# Altium schematic sheet power_12V.SchDoc: 12V PWR
size A4; Organization: Badgerloop Electrical; Address1: 133 Engineering Research Building; Address2: 1500 Engineering Drive; Address3: Madison, Wi 53706; SheetNumber: 6
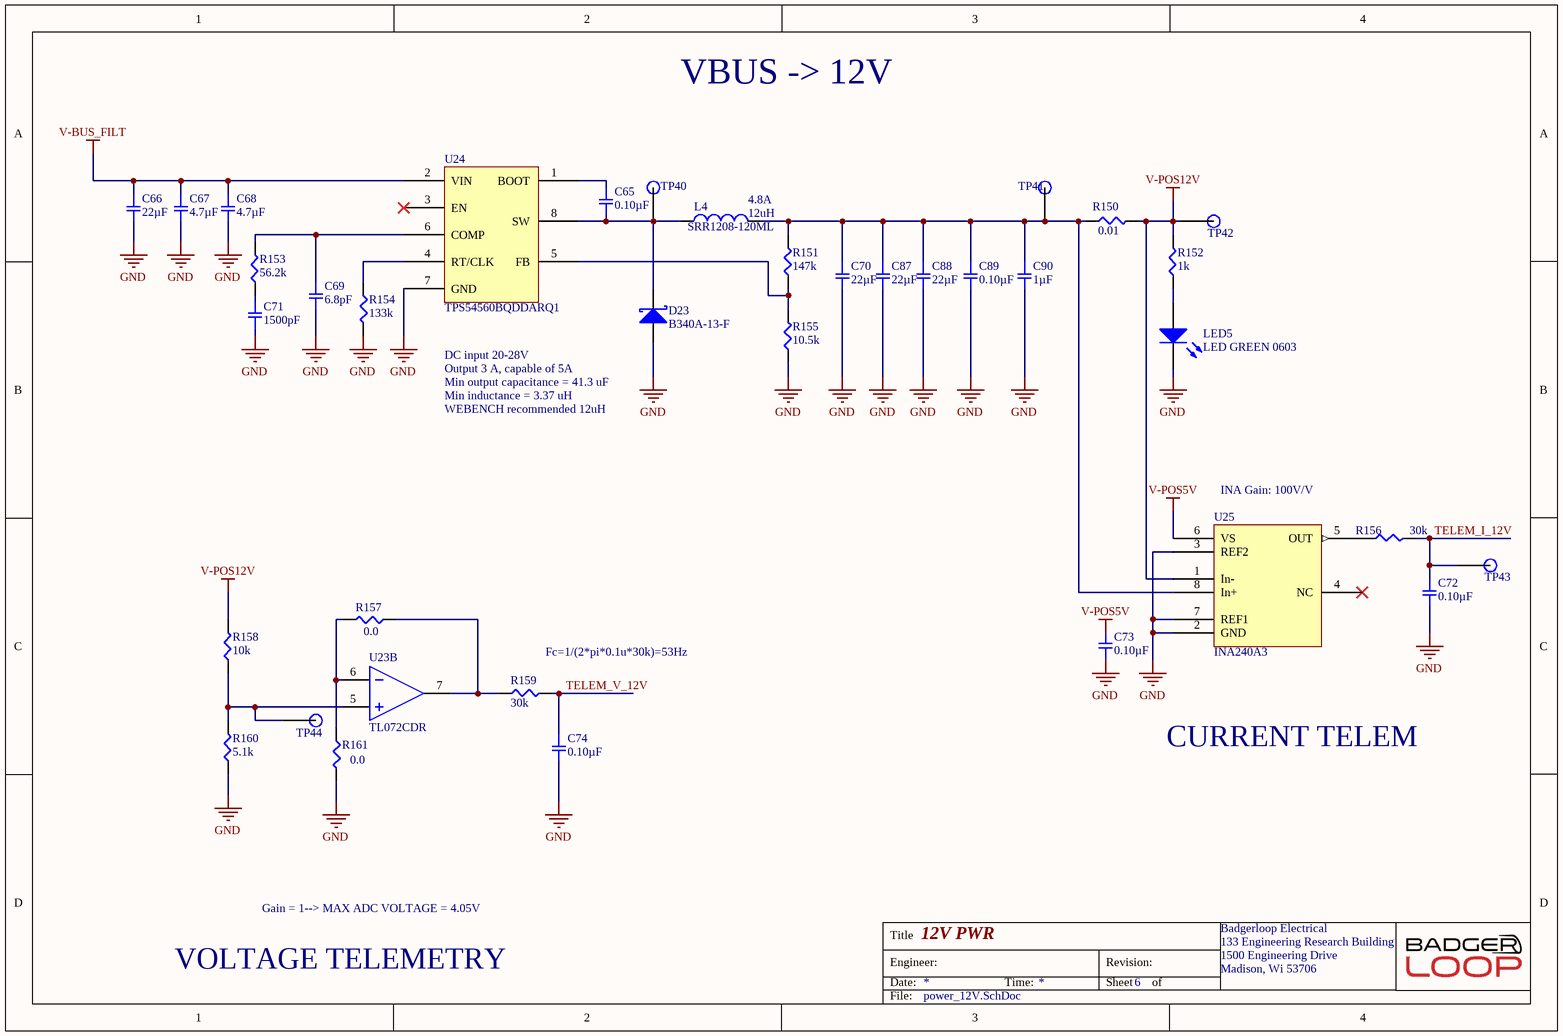
[diagram p0: power_12V.SchDoc]

## Parts
C65  0.10µF  [SMD-0805C]
C66  22µF  [SMD-1206C]
C67  4.7µF  [SMD-0805C]
C68  4.7µF  [SMD-0805C]
C69  6.8pF  [SMD-0805C]
C70  22µF  [SMD-1206C]
C71  1500pF  [SMD-0805C]
C72  0.10µF  [SMD-0805C]
C73  0.10µF  [SMD-0805C]
C74  0.10µF  [SMD-0805C]
C87  22µF  [SMD-1206C]
C88  22µF  [SMD-1206C]
C89  0.10µF  [SMD-0805C]
C90  1µF  [SMD-0805C]
D23  B340A-13-F  [DIOM4326X20N]
L4  SRR1208-120ML  Current Rating: 4.8A  Inductance: 12uH  [INDP127127X83N]
LED5  LED GREEN 0603  [LED 0603 GREEN]
R150  0.01  [SMD-1206-RES]
R151  147k  [SMD-0805-RES]
R152  1k  [SMD-0805-RES]
R153  56.2k  [SMD-0805-RES]
R154  133k  [SMD-0805-RES]
R155  10.5k  [SMD-0805-RES]
R156  30k  [SMD-0805-RES]
R157  0.0  [SMD-0805-RES]
R158  10k  [SMD-0805-RES]
R159  30k  [SMD-0805-RES]
R160  5.1k  [SMD-0805-RES]
R161  0.0  [SMD-0805-RES]
TP40  TP  [Test Point]  (value not drawn)
TP41  TP  [Test Point]  (value not drawn)
TP42  TP  [Test Point]  (value not drawn)
TP43  TP  [Test Point]  (value not drawn)
TP44  TP  [Test Point]  (value not drawn)
U23  TL072CDR  [SOP127P600X175-8N]  (part B of 2)
U24  TPS54560BQDDARQ1  [SOP127P600X175-8N - Thermal Pad]
U25  INA240A3  [SOIC127P600X175-8N]

## Nets
GND: C66.2 C67.2 C68.2 C69.2 C70.2 C71.1 C72.2 C73.1 C74.2 C87.2 C88.2 C89.2 C90.2 D23.2(A) LED5.2(K) R154.2 R155.1 R160.1 R161.2 U24.7(GND) U25.2(GND) U25.3(REF2) U25.7(REF1)
V-BUS_FILT: C66.1 C67.1 C68.1 U24.2(VIN)
V-POS5V: C73.2 U25.6(VS)
V-POS12V: R150.2 R152.2 R158.2 TP42.1 U25.1(In-)
TELEM_I_12V: C72.1 R156.2 TP43.1
TELEM_V_12V: C74.1 R159.2
NetC65_1: C65.1 U24.1(BOOT)
NetC65_2: C65.2 D23.1(K) L4.1 TP40.1 U24.8(SW)
NetC69_1: C69.1 R153.2 U24.6(COMP)
NetC70_1: C70.1 C87.1 C88.1 C89.1 C90.1 L4.2 R150.1 R151.2 TP41.1 U25.8(In+)
NetC71_2: C71.2 R153.1
NetLED5_1: LED5.1(A) R152.1
NetR151_1: R151.1 R155.2 U24.5(FB)
NetR154_1: R154.1 U24.4(RT/CLK)
NetR156_1: R156.1 U25.5(OUT)
NetR157_1: R157.1 R159.1 U23.7(OUT)
NetR157_2: R157.2 R161.1 U23.6(IN-)
NetR158_1: R158.1 R160.2 TP44.1 U23.5(IN+)

Not connected (* = marked no-connect by the designer): U24 3(EN)*; U25 4(NC)*

## Notes on the sheet
- VBUS -> 12V
- DC input 20-28V
- Output 3 A, capable of 5A
- Min output capacitance = 41.3 uF
- Min inductance = 3.37 uH
- WEBENCH recommended 12uH
- (near U25) INA Gain: 100V/V
- (near R159) Fc=1/(2*pi*0.1u*30k)=53Hz
- CURRENT TELEM
- Gain = 1--> MAX ADC VOLTAGE = 4.05V
- VOLTAGE TELEMETRY
- Title
- Engineer:
- Date:
- Time:
- Revision:
- Sheet
- of
- File:

## Library data of the parts
C65 = GCD21BR71H104KA01L: CAP CER 0.1UF 50V X7R 0805; Manufacturer: Murata Electronics North America; Factory Stock: 0; Unit Price (USD): 0.24; Minimum Quantity: 1; Tolerance: ±10%; Datasheets: http://www.murata.com/~/media/webrenewal/support/library/catalog/products/capacitor/mlcc/c03e.ashx; Image: //media.digikey.com/Renders/Murata%20Renders/0805%28GxM6%29.jpg; Digi-Key Part Number: 490-11955-1-ND; Part Number: GCD21BR71H104KA01L; Quantity Available: 157; @ qty: 0; Packaging: Cut Tape (CT); Series: GCD; Part Status: Active; Value: 0.10µF; Voltage: 50V; Temperature Coefficient: X7R; Operating Temperature: -55°C ~ 125°C; Features: -; Ratings: AEC-Q200; Applications: Automotive; Mounting Type: Surface Mount, MLCC; Package / Case: 0805 (2012 Metric); Size / Dimension: 0.079" L x 0.049" W (2.00mm x 1.25mm); Height - Seated (Max): -; Thickness (Max): 0.049" (1.25mm); Lead Spacing: -; Lead Style: -
C66 C70 C87 C88 = GRT31CR61E226ME01L: CAP CER 22UF 25V X5R 1206; Manufacturer: Murata Electronics North America; Factory Stock: 0; Unit Price (USD): 0.52; Minimum Quantity: 1; Tolerance: ±20%; Datasheets: http://search.murata.co.jp/Ceramy/image/img/A01X/G101/ENG/GRT31CR61E226ME01-01.pdf; Image: //media.digikey.com/Renders/Murata%20Renders/GR331BD72E473KW01L.jpg; Digi-Key Part Number: 490-12451-1-ND; Part Number: GRT31CR61E226ME01L; Quantity Available: 4719; @ qty: 0; Packaging: Cut Tape (CT); Series: GRT; Part Status: Active; Value: 22µF; Voltage: 25V; Temperature Coefficient: X5R; Operating Temperature: -55°C ~ 85°C; Features: -; Ratings: AEC-Q200; Applications: Automotive; Mounting Type: Surface Mount, MLCC; Package / Case: 1206 (3216 Metric); Size / Dimension: 0.126" L x 0.063" W (3.20mm x 1.60mm); Height - Seated (Max): -; Thickness (Max): 0.071" (1.80mm); Lead Spacing: -; Lead Style: -
C67 C68 = GRT21BR61H475ME13L: CAP CER 4.7UF 50V X5R 0805; Manufacturer: Murata Electronics North America; Factory Stock: 0; Unit Price (USD): 0.37; Minimum Quantity: 1; Tolerance: ±20%; Datasheets: http://search.murata.co.jp/Ceramy/image/img/A01X/G101/ENG/GRT21BR61H475ME13-01.pdf; Image: //media.digikey.com/Renders/Murata%20Renders/GRT%20Series%200805(2012%20Metric).jpg; Digi-Key Part Number: 490-12395-1-ND; Part Number: GRT21BR61H475ME13L; Quantity Available: 4227; @ qty: 0; Packaging: Cut Tape (CT); Series: GRT; Part Status: Active; Value: 4.7µF; Voltage: 50V; Temperature Coefficient: X5R; Operating Temperature: -55°C ~ 85°C; Features: -; Ratings: AEC-Q200; Applications: Automotive; Mounting Type: Surface Mount, MLCC; Package / Case: 0805 (2012 Metric); Size / Dimension: 0.079" L x 0.049" W (2.00mm x 1.25mm); Height - Seated (Max): -; Thickness (Max): 0.057" (1.45mm); Lead Spacing: -; Lead Style: -
C69 = GQM2195C2A6R8CB01D: CAP CER 6.8PF 100V NP0 0805; Manufacturer: Murata Electronics North America; Factory Stock: 0; Unit Price (USD): 0.71; Minimum Quantity: 1; Tolerance: ±0.25pF; Temperature Coefficient: C0G, NP0; Datasheets: http://www.murata.com/~/media/webrenewal/support/library/catalog/products/capacitor/mlcc/c02e.pdf; Image: //media.digikey.com/Renders/Murata%20Renders/0805(GxM9).jpg; Digi-Key Part Number: 490-3596-1-ND; Part Number: GQM2195C2A6R8CB01D; Quantity Available: 5718; @ qty: 0; Packaging: Cut Tape (CT); Series: GQM; Part Status: Active; Value: 6.8pF; Voltage: 100V; Operating Temperature: -55°C ~ 125°C; Features: High Q, Low Loss; Ratings: -; Applications: RF, Microwave, High Frequency; Mounting Type: Surface Mount, MLCC; Package / Case: 0805 (2012 Metric); Size / Dimension: 0.079" L x 0.049" W (2.00mm x 1.25mm); Height - Seated (Max): -; Thickness (Max): 0.037" (0.95mm); Lead Spacing: -; Lead Style: -
C71 = GRM2165C1H152FA01D: CAP CER 1500PF 50V NP0 0805; Manufacturer: Murata Electronics North America; Factory Stock: 0; Unit Price (USD): 0.28; Minimum Quantity: 1; Tolerance: ±1%; Temperature Coefficient: C0G, NP0; Datasheets: http://www.murata.com/~/media/webrenewal/support/library/catalog/products/capacitor/mlcc/c02e.pdf; Image: //media.digikey.com/Renders/Murata%20Renders/0805%20(2012%20Metric)%20.85mm.jpg; Digi-Key Part Number: 490-7772-1-ND; Part Number: GRM2165C1H152FA01D; Quantity Available: 15785; @ qty: 0; Packaging: Cut Tape (CT); Series: GRM; Part Status: Active; Value: 1500pF; Voltage: 50V; Operating Temperature: -55°C ~ 125°C; Features: -; Ratings: -; Applications: General Purpose; Mounting Type: Surface Mount, MLCC; Package / Case: 0805 (2012 Metric); Size / Dimension: 0.079" L x 0.049" W (2.00mm x 1.25mm); Height - Seated (Max): -; Thickness (Max): 0.028" (0.70mm); Lead Spacing: -; Lead Style: -
C72 C74 = GRM219R71C104KA01D: CAP CER 0.1UF 16V X7R 0805; Manufacturer: Murata Electronics North America; Factory Stock: 0; Unit Price (USD): 0.13; Minimum Quantity: 1; Tolerance: ±10%; Datasheets: http://www.murata.com/~/media/webrenewal/support/library/catalog/products/capacitor/mlcc/c02e.pdf; Image: //media.digikey.com/Renders/Murata%20Renders/0805%20(2012%20Metric)%20.85mm.jpg; Digi-Key Part Number: 490-1683-1-ND; Part Number: GRM219R71C104KA01D; Quantity Available: 265464; @ qty: 0; Packaging: Cut Tape (CT); Series: GRM; Part Status: Active; Value: 0.10µF; Voltage: 16V; Temperature Coefficient: X7R; Operating Temperature: -55°C ~ 125°C; Features: -; Ratings: -; Applications: General Purpose; Mounting Type: Surface Mount, MLCC; Package / Case: 0805 (2012 Metric); Size / Dimension: 0.079" L x 0.049" W (2.00mm x 1.25mm); Height - Seated (Max): -; Thickness (Max): 0.037" (0.95mm); Lead Spacing: -; Lead Style: -
C73 C89 = GRM21B7U1A104JA01L: CAP CER 0.1UF 10V U2J 0805; Manufacturer: Murata Electronics North America; Factory Stock: 0; Unit Price (USD): 0.4; Minimum Quantity: 1; Tolerance: ±5%; Datasheets: http://www.murata.com/~/media/webrenewal/support/library/catalog/products/capacitor/mlcc/c02e.pdf; Image: //media.digikey.com/Renders/Murata%20Renders/0805%20(2012%20Metric)%20.85mm.jpg; Digi-Key Part Number: 490-11592-1-ND; Part Number: GRM21B7U1A104JA01L; Quantity Available: 3390; @ qty: 0; Packaging: Cut Tape (CT); Series: GRM; Part Status: Active; Value: 0.10µF; Voltage: 10V; Temperature Coefficient: U2J; Operating Temperature: -55°C ~ 125°C; Features: -; Ratings: -; Applications: General Purpose; Mounting Type: Surface Mount, MLCC; Package / Case: 0805 (2012 Metric); Size / Dimension: 0.079" L x 0.049" W (2.00mm x 1.25mm); Height - Seated (Max): -; Thickness (Max): 0.053" (1.35mm); Lead Spacing: -; Lead Style: -
C90 = GRM21BR71H105KA12L: CAP CER 1UF 50V X7R 0805; Manufacturer: Murata Electronics North America; Factory Stock: 0; Unit Price (USD): 0.25; Minimum Quantity: 1; Tolerance: ±10%; Datasheets: http://www.murata.com/~/media/webrenewal/support/library/catalog/products/capacitor/mlcc/c02e.pdf; Image: //media.digikey.com/Renders/Murata%20Renders/0805%20(2012%20Metric)%20.85mm.jpg; Digi-Key Part Number: 490-4736-1-ND; Part Number: GRM21BR71H105KA12L; Quantity Available: 988032; @ qty: 0; Packaging: Cut Tape (CT); Series: GRM; Part Status: Active; Value: 1µF; Voltage: 50V; Temperature Coefficient: X7R; Operating Temperature: -55°C ~ 125°C; Features: -; Ratings: -; Applications: General Purpose; Mounting Type: Surface Mount, MLCC; Package / Case: 0805 (2012 Metric); Size / Dimension: 0.079" L x 0.049" W (2.00mm x 1.25mm); Height - Seated (Max): -; Thickness (Max): 0.053" (1.35mm); Lead Spacing: -; Lead Style: -
D23 = B340A-13-F: DIODE SCHOTTKY 40V 3A SMA; Manufacturer: Diodes; Element Configuration: Single; Peak Reverse Current: 500uA; Forward Voltage: 500mV; Max Forward Surge Current (Ifsm): 80A; Polarity: Standard; Capacitance: 250pF; Supplier 1: Digi-Key; Stock 1: 438328; Pricing 1: 1=0.42000, 10=0.33900, 100=0.23070, 500=0.17304, 1000=0.12978 (USD); RoHS: Yes; Mount: Surface Mount; Case/Package: SMA; Number of Pins: 2; Weight: 0.002258oz; Contact Plating: Tin,Matte; Min Operating Temperature: -55°C; Max Operating Temperature: 125°C; Forward Current: 3A; Max Repetitive Reverse Voltage (Vrrm): 40V; Packaging: Tape and Reel; Peak Non-Repetitive Surge Current: 80A; Package Quantity: 5000; Average Rectified Current: 3A; Termination: SMD/SMT; Voltage Rating (DC): 40V; Current Rating: 3A; Output Current: 3A; Current: 3A; Voltage: 40V; Max Reverse Voltage (DC): 40V; Length: 4.6mm; Height: 2.3mm; Width: 2.92mm; Radiation Hardening: No; REACH SVHC: No SVHC; Lead Free: Lead Free; ComponentLink1URL: https://datasheet.ciiva.com/26949/getdatasheetpartid-143394-26949352.pdf?src-supplier=Verical; ComponentLink1Description: https://datasheet.ciiva.com/26949/getdatasheetpartid-143394-26949352.pdf?src-supplier=Verical; ComponentLink2URL: https://datasheet.ciiva.com/4245/861ds30891-4245763.pdf?src-supplier=Arrow; ComponentLink2Description: https://datasheet.ciiva.com/4245/861ds30891-4245763.pdf?src-supplier=Arrow; ComponentLink3URL: https://datasheet.ciiva.com/1177/ds30891-1177476.pdf?src-supplier=Element14; ComponentLink3Description: https://datasheet.ciiva.com/1177/ds30891-1177476.pdf?src-supplier=Element14; ComponentLink4URL: https://datasheet.ciiva.com/913/ds30891-913638.pdf?src-supplier=Digi-Key; ComponentLink4Description: https://datasheet.ciiva.com/913/ds30891-913638.pdf?src-supplier=Digi-Key; ComponentLink5URL: https://datasheet.ciiva.com/46393/1911813-46393773.pdf?src-supplier=Element14; ComponentLink5Description: https://datasheet.ciiva.com/46393/1911813-46393773.pdf?src-supplier=Element14; ComponentLink6URL: https://datasheet.ciiva.com/1240/ds30891-1240228.pdf?src-supplier=Newark; ComponentLink6Description: https://datasheet.ciiva.com/1240/ds30891-1240228.pdf?src-supplier=Newark; ComponentLink7URL: https://datasheet.ciiva.com/913/ds30891-913637.pdf?src-supplier=Digi-Key; ComponentLink7Description: https://datasheet.ciiva.com/913/ds30891-913637.pdf?src-supplier=Digi-Key; ComponentLink8URL: https://datasheet.ciiva.com/913/ds30891-913639.pdf?src-supplier=Digi-Key; ComponentLink8Description: https://datasheet.ciiva.com/913/ds30891-913639.pdf?src-supplier=Digi-Key; Supplier Part Number 1: B340A-FDICT-ND
L4 = SRR1208-120ML: BOURNS - SRR1208-120ML - INDUCTOR, SHIELDED, 12UH, 6.5A, 20%, SMD; Core Material: Ferrite; Material: Steel; DC Resistance (DCR): 25mR; Self Resonant Frequency: 11MHz; Q Factor: 19; Test Frequency: 1kHz; Supplier 1: Digi-Key; Manufacturer: Bourns; Stock 1: 1840; Pricing 1: 1=1.13, 10=1.047, 100=0.7567 (USD); Mount: Surface Mount; Case/Package: 1208; Min Operating Temperature: -40°C; Max Operating Temperature: 125°C; Tolerance: 20%; Max DC Current: 4.8A; Packaging: Tape and Reel; Shielding: Shielded; Frequency: 11MHz; Package Quantity: 400; Saturation Current: 6.5A; Resistance: 25MR; Termination: SMD/SMT; Composition: Wirewound; DC Current: 4.8A; Military Standard: Not; RMS Current (Irms): 4.8A; Inductance Tolerance: 20%; Length: 12.7mm; Height: 8.5mm; Width: 12.7mm; Height - Seated (Max): 0.335inch; Depth: 13mm; Radiation Hardening: No; REACH SVHC: No SVHC; ComponentLink1URL: http://www.bourns.com/pdfs/srr1208.pdf?src-supplier=Avnet; ComponentLink1Description: http://www.bourns.com/pdfs/srr1208.pdf?src-supplier=Avnet; ComponentLink2URL: http://www.mouser.com/ds/2/54/rr1208-777886.pdf?src-supplier=Mouser; ComponentLink2Description: http://www.mouser.com/ds/2/54/rr1208-777886.pdf?src-supplier=Mouser; ComponentLink3URL: http://www.bourns.com/pdfs/srr1208.pdf?src-supplier=Avnet+Europe; ComponentLink3Description: http://www.bourns.com/pdfs/srr1208.pdf?src-supplier=Avnet+Europe; ComponentLink4URL: http://www.bourns.com/docs/Product-Datasheets/SRR1208.pdf?src-supplier=Digi-Key; ComponentLink4Description: http://www.bourns.com/docs/Product-Datasheets/SRR1208.pdf?src-supplier=Digi-Key; ComponentLink5URL: https://www.bourns.com/docs/Product-Datasheets/SRR1208.pdf?src-supplier=Digi-Key; ComponentLink5Description: https://www.bourns.com/docs/Product-Datasheets/SRR1208.pdf?src-supplier=Digi-Key; ComponentLink6URL: http://www.produktinfo.conrad.com/datenblaetter/1000000-1099999/001056588-da-01-en-MAG_ABGE_L_IND_SRR1208_120ML_12UH_4_8A.pdf?src-supplier=Conrad; ComponentLink6Description: http://www.produktinfo.conrad.com/datenblaetter/1000000-1099999/001056588-da-01-en-MAG_ABGE_L_IND_SRR1208_120ML_12UH_4_8A.pdf?src-supplier=Conrad; Supplier Part Number 1: SRR1208-120MLDKR-ND
LED5 = LED GREEN 0603: Manufacturer: Lite-On Inc.; Manufacturer P/N: LTST-C190KGKT; Digikey P/N: 160-1435-1-ND; Package / Case: 0603; Color: GREEN
R150 = ERJ-MP2KF10MU: RES SMD 0.01 OHM 1% 1/2W 1206; Manufacturer: Panasonic Electronic Components; Factory Stock: 0; Unit Price (USD): 0.15792; @ qty: 1500; Minimum Quantity: 1; Power (Watts): 0.5W, 1/2W; Temperature Coefficient: ±75ppm/°C; Part Number: ERJ-MP2KF10MU; Datasheets: https://industrial.panasonic.com/cdbs/www-data/pdf/RDA0000/AOA0000C263.pdf; Image: //media.digikey.com/Photos/Panasonic%20Elect%20Works%20Photos/MFG_ERJ-MS4.jpg; Digi-Key Part Number: P19322CT-ND; Quantity Available: 2909; Packaging: Cut Tape (CT); Series: ERJ; Part Status: Active; Value: 0.01; Tolerance: ±1%; Composition: Metal Element; Features: Automotive AEC-Q200, Current Sense, Moisture Resistant; Operating Temperature: -65°C ~ 170°C; Package / Case: 1206 (3216 Metric); Supplier Device Package: 1206; Size / Dimension: 0.125" L x 0.063" W (3.18mm x 1.60mm); Height - Seated (Max): 0.045" (1.15mm); Number of Terminations: 2; Failure Rate: -
R151 = ERJ-6ENF1473V: RES SMD 147K OHM 1% 1/8W 0805; Manufacturer: Panasonic Electronic Components; Factory Stock: 0; Unit Price (USD): 0.00729; @ qty: 1500; Minimum Quantity: 1; Power (Watts): 0.125W, 1/8W; Temperature Coefficient: ±100ppm/°C; Part Number: ERJ-6ENF1473V; Datasheets: http://industrial.panasonic.com/www-cgi/jvcr13pz.cgi?E+PZ+3+AOA0002+ERJ6ENF1473V+7+WW; Image: //media.digikey.com/Renders/Panasonic%20Renders/ERJ-0805%20Pkg.jpg; Digi-Key Part Number: P147KCCT-ND; Quantity Available: 10283; Packaging: Cut Tape (CT); Series: ERJ; Part Status: Active; Value: 147k; Tolerance: ±1%; Composition: Thick Film; Features: Automotive AEC-Q200; Operating Temperature: -55°C ~ 155°C; Package / Case: 0805 (2012 Metric); Supplier Device Package: 0805; Size / Dimension: 0.079" L x 0.049" W (2.00mm x 1.25mm); Height - Seated (Max): 0.028" (0.70mm); Number of Terminations: 2; Failure Rate: -
R152 = ERJ-P06J102V: RES SMD 1K OHM 5% 1/2W 0805; Manufacturer: Panasonic Electronic Components; Factory Stock: 0; Unit Price (USD): 0.01839; @ qty: 1500; Minimum Quantity: 1; Power (Watts): 0.5W, 1/2W; Temperature Coefficient: ±200ppm/°C; Part Number: ERJ-P06J102V; Datasheets: https://industrial.panasonic.com/cdbs/www-data/pdf/RDA0000/AOA0000C243.pdf; Image: //media.digikey.com/Renders/Panasonic%20Renders/ERJ-0805%20Pkg.jpg; Digi-Key Part Number: P1.0KADCT-ND; Quantity Available: 124757; Packaging: Cut Tape (CT); Series: ERJ; Part Status: Active; Value: 1k; Tolerance: ±5%; Composition: Thick Film; Features: Automotive AEC-Q200, Pulse Withstanding; Operating Temperature: -55°C ~ 155°C; Package / Case: 0805 (2012 Metric); Supplier Device Package: 0805; Size / Dimension: 0.079" L x 0.049" W (2.00mm x 1.25mm); Height - Seated (Max): 0.028" (0.70mm); Number of Terminations: 2; Failure Rate: -
R153 = ERJ-6ENF5622V: RES SMD 56.2K OHM 1% 1/8W 0805; Manufacturer: Panasonic Electronic Components; Factory Stock: 0; Unit Price (USD): 0.00729; @ qty: 1500; Minimum Quantity: 1; Power (Watts): 0.125W, 1/8W; Temperature Coefficient: ±100ppm/°C; Part Number: ERJ-6ENF5622V; Datasheets: http://industrial.panasonic.com/www-cgi/jvcr13pz.cgi?E+PZ+3+AOA0002+ERJ6ENF5622V+7+WW; Image: //media.digikey.com/Renders/Panasonic%20Renders/ERJ-0805%20Pkg.jpg; Digi-Key Part Number: P56.2KCCT-ND; Quantity Available: 60556; Packaging: Cut Tape (CT); Series: ERJ; Part Status: Active; Value: 56.2k; Tolerance: ±1%; Composition: Thick Film; Features: Automotive AEC-Q200; Operating Temperature: -55°C ~ 155°C; Package / Case: 0805 (2012 Metric); Supplier Device Package: 0805; Size / Dimension: 0.079" L x 0.049" W (2.00mm x 1.25mm); Height - Seated (Max): 0.028" (0.70mm); Number of Terminations: 2; Failure Rate: -
R154 = ERJ-6ENF1333V: RES SMD 133K OHM 1% 1/8W 0805; Manufacturer: Panasonic Electronic Components; Factory Stock: 0; Unit Price (USD): 0.00729; @ qty: 1500; Minimum Quantity: 1; Power (Watts): 0.125W, 1/8W; Temperature Coefficient: ±100ppm/°C; Part Number: ERJ-6ENF1333V; Datasheets: http://industrial.panasonic.com/www-cgi/jvcr13pz.cgi?E+PZ+3+AOA0002+ERJ6ENF1333V+7+WW; Image: //media.digikey.com/Renders/Panasonic%20Renders/ERJ-0805%20Pkg.jpg; Digi-Key Part Number: P133KCCT-ND; Quantity Available: 12530; Packaging: Cut Tape (CT); Series: ERJ; Part Status: Active; Value: 133k; Tolerance: ±1%; Composition: Thick Film; Features: Automotive AEC-Q200; Operating Temperature: -55°C ~ 155°C; Package / Case: 0805 (2012 Metric); Supplier Device Package: 0805; Size / Dimension: 0.079" L x 0.049" W (2.00mm x 1.25mm); Height - Seated (Max): 0.028" (0.70mm); Number of Terminations: 2; Failure Rate: -
R155 = ERJ-6ENF1052V: RES SMD 10.5K OHM 1% 1/8W 0805; Manufacturer: Panasonic Electronic Components; Factory Stock: 0; Unit Price (USD): 0.00729; @ qty: 1500; Minimum Quantity: 1; Power (Watts): 0.125W, 1/8W; Temperature Coefficient: ±100ppm/°C; Part Number: ERJ-6ENF1052V; Datasheets: http://industrial.panasonic.com/www-cgi/jvcr13pz.cgi?E+PZ+3+AOA0002+ERJ6ENF1052V+7+WW; Image: //media.digikey.com/Renders/Panasonic%20Renders/ERJ-0805%20Pkg.jpg; Digi-Key Part Number: P10.5KCCT-ND; Quantity Available: 20335; Packaging: Cut Tape (CT); Series: ERJ; Part Status: Active; Value: 10.5k; Tolerance: ±1%; Composition: Thick Film; Features: Automotive AEC-Q200; Operating Temperature: -55°C ~ 155°C; Package / Case: 0805 (2012 Metric); Supplier Device Package: 0805; Size / Dimension: 0.079" L x 0.049" W (2.00mm x 1.25mm); Height - Seated (Max): 0.028" (0.70mm); Number of Terminations: 2; Failure Rate: -
R156 = ERJ-6ENF3002V: RES SMD 30K OHM 1% 1/8W 0805; Manufacturer: Panasonic Electronic Components; Factory Stock: 0; Unit Price (USD): 0.00729; @ qty: 1500; Minimum Quantity: 1; Power (Watts): 0.125W, 1/8W; Temperature Coefficient: ±100ppm/°C; Part Number: ERJ-6ENF3002V; Datasheets: http://industrial.panasonic.com/www-cgi/jvcr13pz.cgi?E+PZ+3+AOA0002+ERJ6ENF3002V+7+WW; Image: //media.digikey.com/Renders/Panasonic%20Renders/ERJ-0805%20Pkg.jpg; Digi-Key Part Number: P30.0KCCT-ND; Quantity Available: 88046; Packaging: Cut Tape (CT); Series: ERJ; Part Status: Active; Value: 30k; Tolerance: ±1%; Composition: Thick Film; Features: Automotive AEC-Q200; Operating Temperature: -55°C ~ 155°C; Package / Case: 0805 (2012 Metric); Supplier Device Package: 0805; Size / Dimension: 0.079" L x 0.049" W (2.00mm x 1.25mm); Height - Seated (Max): 0.028" (0.70mm); Number of Terminations: 2; Failure Rate: -
R157 R161 = ERJ-6GEY0R00V: RES SMD 0.0 OHM JUMPER 1/8W 0805; Manufacturer: Panasonic Electronic Components; Factory Stock: 0; Unit Price (USD): 0.00544; @ qty: 1500; Minimum Quantity: 1; Power (Watts): 0.125W, 1/8W; Part Number: ERJ-6GEY0R00V; Datasheets: http://industrial.panasonic.com/www-cgi/jvcr13pz.cgi?E+PZ+3+AOA0001+ERJ6GEY0R00V+7+WW; Image: //media.digikey.com/Renders/Panasonic%20Renders/ERJ-0805%20Pkg.jpg; Digi-Key Part Number: P0.0ACT-ND; Quantity Available: 1597627; Packaging: Cut Tape (CT); Series: ERJ; Part Status: Active; Value: 0.0; Tolerance: Jumper; Composition: Thick Film; Features: Automotive AEC-Q200; Temperature Coefficient: -; Operating Temperature: -55°C ~ 155°C; Package / Case: 0805 (2012 Metric); Supplier Device Package: 0805; Size / Dimension: 0.079" L x 0.049" W (2.00mm x 1.25mm); Height - Seated (Max): 0.028" (0.70mm); Number of Terminations: 2; Failure Rate: -
R158 = ERJ-P06J103V: RES SMD 10K OHM 5% 1/2W 0805; Manufacturer: Panasonic Electronic Components; Factory Stock: 0; Unit Price (USD): 0.01839; @ qty: 1500; Minimum Quantity: 1; Power (Watts): 0.5W, 1/2W; Temperature Coefficient: ±200ppm/°C; Part Number: ERJ-P06J103V; Datasheets: https://industrial.panasonic.com/cdbs/www-data/pdf/RDA0000/AOA0000C243.pdf; Image: //media.digikey.com/Renders/Panasonic%20Renders/ERJ-0805%20Pkg.jpg; Digi-Key Part Number: P10KADCT-ND; Quantity Available: 413576; Packaging: Cut Tape (CT); Series: ERJ; Part Status: Active; Value: 10k; Tolerance: ±5%; Composition: Thick Film; Features: Automotive AEC-Q200, Pulse Withstanding; Operating Temperature: -55°C ~ 155°C; Package / Case: 0805 (2012 Metric); Supplier Device Package: 0805; Size / Dimension: 0.079" L x 0.049" W (2.00mm x 1.25mm); Height - Seated (Max): 0.028" (0.70mm); Number of Terminations: 2; Failure Rate: -
R159 = ERJ-P06J303V: RES SMD 30K OHM 5% 1/2W 0805; Manufacturer: Panasonic Electronic Components; Factory Stock: 0; Unit Price (USD): 0.01839; @ qty: 1500; Minimum Quantity: 1; Power (Watts): 0.5W, 1/2W; Temperature Coefficient: ±200ppm/°C; Part Number: ERJ-P06J303V; Datasheets: https://industrial.panasonic.com/cdbs/www-data/pdf/RDA0000/AOA0000C243.pdf; Image: //media.digikey.com/Renders/Panasonic%20Renders/ERJ-0805%20Pkg.jpg; Digi-Key Part Number: P30KADCT-ND; Quantity Available: 7773; Packaging: Cut Tape (CT); Series: ERJ; Part Status: Active; Value: 30k; Tolerance: ±5%; Composition: Thick Film; Features: Automotive AEC-Q200, Pulse Withstanding; Operating Temperature: -55°C ~ 155°C; Package / Case: 0805 (2012 Metric); Supplier Device Package: 0805; Size / Dimension: 0.079" L x 0.049" W (2.00mm x 1.25mm); Height - Seated (Max): 0.028" (0.70mm); Number of Terminations: 2; Failure Rate: -
R160 = ERJ-6ENF5101V: RES SMD 5.1K OHM 1% 1/8W 0805; Manufacturer: Panasonic Electronic Components; Factory Stock: 0; Unit Price (USD): 0.00729; @ qty: 1500; Minimum Quantity: 1; Power (Watts): 0.125W, 1/8W; Temperature Coefficient: ±100ppm/°C; Part Number: ERJ-6ENF5101V; Datasheets: http://industrial.panasonic.com/www-cgi/jvcr13pz.cgi?E+PZ+3+AOA0002+ERJ6ENF5101V+7+WW; Image: //media.digikey.com/Renders/Panasonic%20Renders/ERJ-0805%20Pkg.jpg; Digi-Key Part Number: P5.10KCCT-ND; Quantity Available: 74332; Packaging: Cut Tape (CT); Series: ERJ; Part Status: Active; Value: 5.1k; Tolerance: ±1%; Composition: Thick Film; Features: Automotive AEC-Q200; Operating Temperature: -55°C ~ 155°C; Package / Case: 0805 (2012 Metric); Supplier Device Package: 0805; Size / Dimension: 0.079" L x 0.049" W (2.00mm x 1.25mm); Height - Seated (Max): 0.028" (0.70mm); Number of Terminations: 2; Failure Rate: -
TP40-TP44 = TP: SMD TEST POINT
U23 = TL072CDR: IC OPAMP JFET 3MHZ 8SOIC; Manufacturer: Texas Instruments; Voltage Gain: 106.02dB; Min Dual Supply Voltage: 3.5V; Max Dual Supply Voltage: 18V; Nominal Supply Current: 5mA; Common Mode Rejection Ratio: 70dB; Number of Channels: 2; Slew Rate: 13V/µs; Max I/O Voltage: 10mV; Input Bias Current: 200pA; Operating Supply Current: 1.4mA; Dual Supply Voltage: 9V; Supplier 1: Digi-Key; Stock 1: 21821; Pricing 1: 1=0.41, 10=0.334, 100=0.2059, 500=0.1562, 1000=0.11715 (USD); Case/Package: D; Number of Pins: 8; Contact Plating: Gold; Min Operating Temperature: -40°C; Max Operating Temperature: 85°C; Package Quantity: 1; Packaging: Tape and Reel; Unity Gain Bandwidth Product: 3MHz; Bandwidth: 3MHz; Nominal Gain Bandwidth Product: 3MHz; Number of Circuits: 2; Gain Bandwidth Product: 3MHz; Input Offset Voltage (Vos): 10mV; Number of Elements: 2; Max Supply Voltage: 18V; Number of Amplifiers: 2; Length: 4.9mm; Height: 1.58mm; Width: 3.91mm; Radiation Hardening: No; Lead Free: Lead Free; REACH SVHC: No SVHC; ComponentLink1URL: http://www.ti.com/lit/ds/symlink/tl071a.pdf?src-supplier=Digi-Key; ComponentLink1Description: http://www.ti.com/lit/ds/symlink/tl071a.pdf?src-supplier=Digi-Key; ComponentLink2URL: http://www.ti.com/general/docs/lit/getliterature.tsp?genericPartNumber=TL072&&fileType=pdf&src-supplier=Avnet; ComponentLink2Description: http://www.ti.com/general/docs/lit/getliterature.tsp?genericPartNumber=TL072&&fileType=pdf&src-supplier=Avnet; ComponentLink3URL: http://www.farnell.com/datasheets/1882732.pdf?src-supplier=Element14; ComponentLink3Description: http://www.farnell.com/datasheets/1882732.pdf?src-supplier=Element14; Supplier Part Number 1: 296-1282-6-ND
U24 = TPS54560BQDDARQ1: IC REG BUCK SPLT ADJ 5A 8PWRSOIC; Manufacturer: Texas Instruments; Output Type: Adjustable; Output Configuration: Positive; Number of Outputs: 1; Min Input Voltage: 4.5V; Max Input Voltage: 60V; Min Output Voltage: 800mV; Max Output Voltage: 58.8V; Switching Frequency: 2.5MHz; Synchronous Rectifier: No; Supplier 1: Digi-Key; Stock 1: 1216; Pricing 1: 1=5.95, 10=5.347, 100=4.1559, 500=3.59428, 1000=2.98775 (USD); Mount: Surface Mount; Number of Pins: 8; Min Operating Temperature: -40°C; Max Operating Temperature: 125°C; Packaging: Tape and Reel; Output Current: 5A; ComponentLink1URL: http://www.ti.com/lit/ds/symlink/tps54560b-q1.pdf?src-supplier=Digi-Key; ComponentLink1Description: http://www.ti.com/lit/ds/symlink/tps54560b-q1.pdf?src-supplier=Digi-Key; Supplier Part Number 1: 296-45534-6-ND
U25 = INA240A3: IC AMP CURRENT SENSE 8-TSSOP 100V/V; Manufacturer: Texas Instruments; Number of Circuits: 1; Slew Rate: 2V/µs; -3db Bandwidth: 400kHz; Input Bias Current: 90uA; Input Offset Voltage (Vos): 5uV; Operating Supply Current: 1.8mA; Supplier 1: Digi-Key; Stock 1: 4680; Pricing 1: 1=2.65, 10=2.377, 25=2.2428, 100=1.7943, 250=1.56996, 500=1.52512, 1000=1.21113 (USD); Mount: Surface Mount; Case/Package: TSSOP; Number of Pins: 8; Min Operating Temperature: -40°C; Max Operating Temperature: 125°C; Packaging: Tape and Reel; ComponentLink1URL: http://www.ti.com/general/docs/lit/getliterature.tsp?genericPartNumber=INA240&fileType=pdf&src-supplier=Farnell; ComponentLink1Description: http://www.ti.com/general/docs/lit/getliterature.tsp?genericPartNumber=INA240&fileType=pdf&src-supplier=Farnell; ComponentLink2URL: http://www.ti.com/lit/ds/symlink/ina240.pdf?src-supplier=Digi-Key; ComponentLink2Description: http://www.ti.com/lit/ds/symlink/ina240.pdf?src-supplier=Digi-Key; Supplier Part Number 1: 296-45090-1-ND